# Altium project druino_uno.PrjPcb
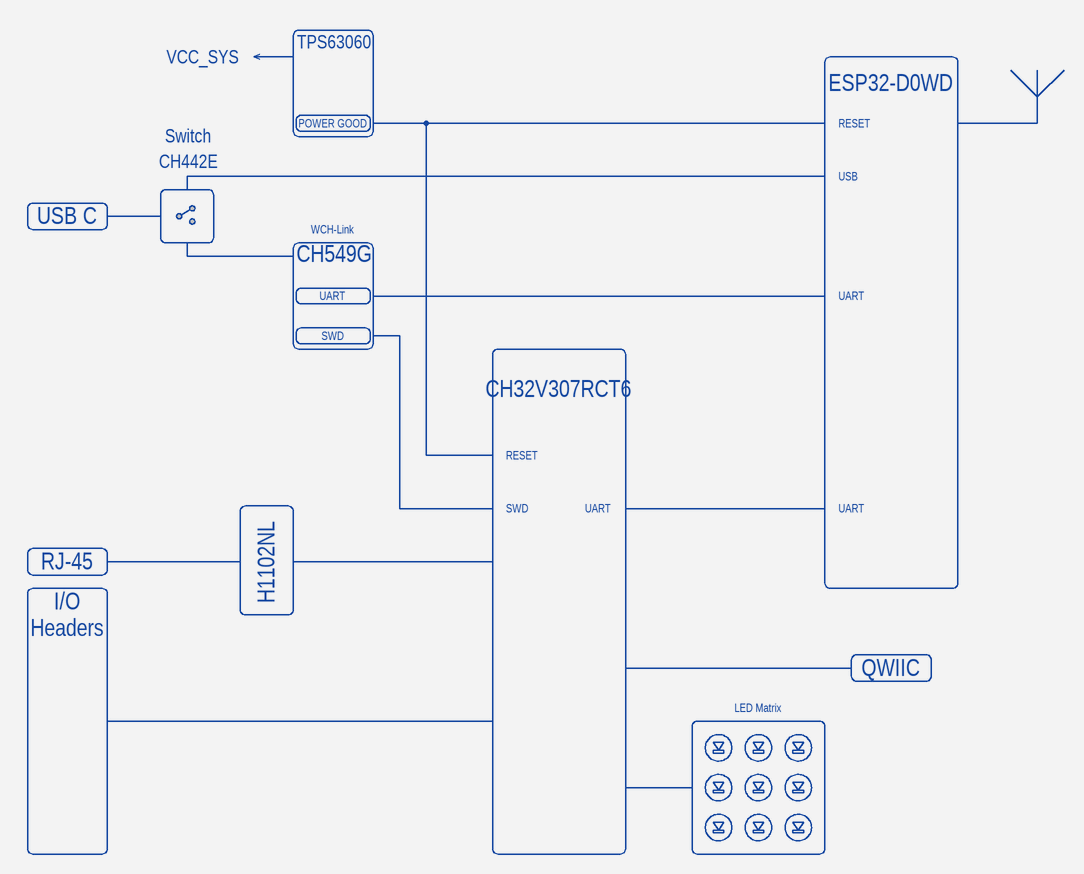
[diagram p0: p1_structure.SchDoc]
6 sheets, 174 parts. Net scope: global (net labels, ports and power ports of the same name join across sheets).
Board file: druino_uno_pcb.PcbDoc
Sheets:
  p1_structure.SchDoc
  p2_power_tree.SchDoc
  p4_esp32.SchDoc
  p5_ethernet.SchDoc
  p6_wch_link.SchDoc
  p8_led_matrix.SchDoc

## Sheet p1_structure.SchDoc
size A4; Organization: ORGANIZATION; Address1: ADDRESS 1; Address2: ADDRESS 2; Address3: ADDRESS 3; Address4: ADDRESS 4; Revision: Rev. A; ENG_APP_DATE: --/--/--; DSN_APP_DATE: --/--/--; CHK_APP_DATE: --/--/--

### Notes on the sheet
- VCC_SYS
- TPS63060
- POWER GOOD
- RESET
- ESP32-D0WD
- Switch
- CH442E
- USB
- USB C
- WCH-Link
- CH549G
- UART
- SWD
- CH32V307RCT6
- RJ-45
- I/O
- H1102NL
- Headers
- QWIIC
- LED Matrix
- A4
- GitHub <https://github.com/kirra-cat/druino-uno>
- view on

## Sheet p2_power_tree.SchDoc
size A4; Organization: ORGANIZATION; Address1: ADDRESS 1; Address2: ADDRESS 2; Address3: ADDRESS 3; Address4: ADDRESS 4; Revision: Rev. A; ENG_APP_DATE: --/--/--; DSN_APP_DATE: --/--/--; CHK_APP_DATE: --/--/--
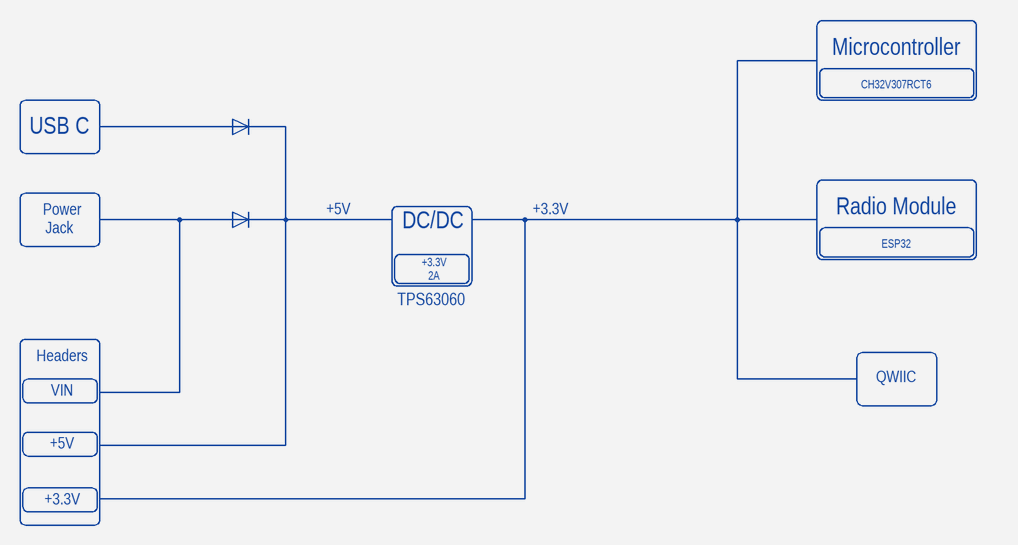
[diagram p1: p2_power_tree.SchDoc]

### Notes on the sheet
- Microcontroller
- USB C
- CH32V307RCT6
- Power
- Radio Module
- Jack
- +5V
- DC/DC
- +3.3V
- 2A
- ESP32
- TPS63060
- Headers
- VIN
- QWIIC
- A4
- GitHub <https://github.com/kirra-cat/druino-uno>
- view on

## Sheet p4_esp32.SchDoc
size A2; Organization: ORGANIZATION; Address1: ADDRESS 1; Address2: ADDRESS 2; Address3: ADDRESS 3; Address4: ADDRESS 4; Revision: Rev. A; ENG_APP_DATE: --/--/--; DSN_APP_DATE: --/--/--; CHK_APP_DATE: --/--/--
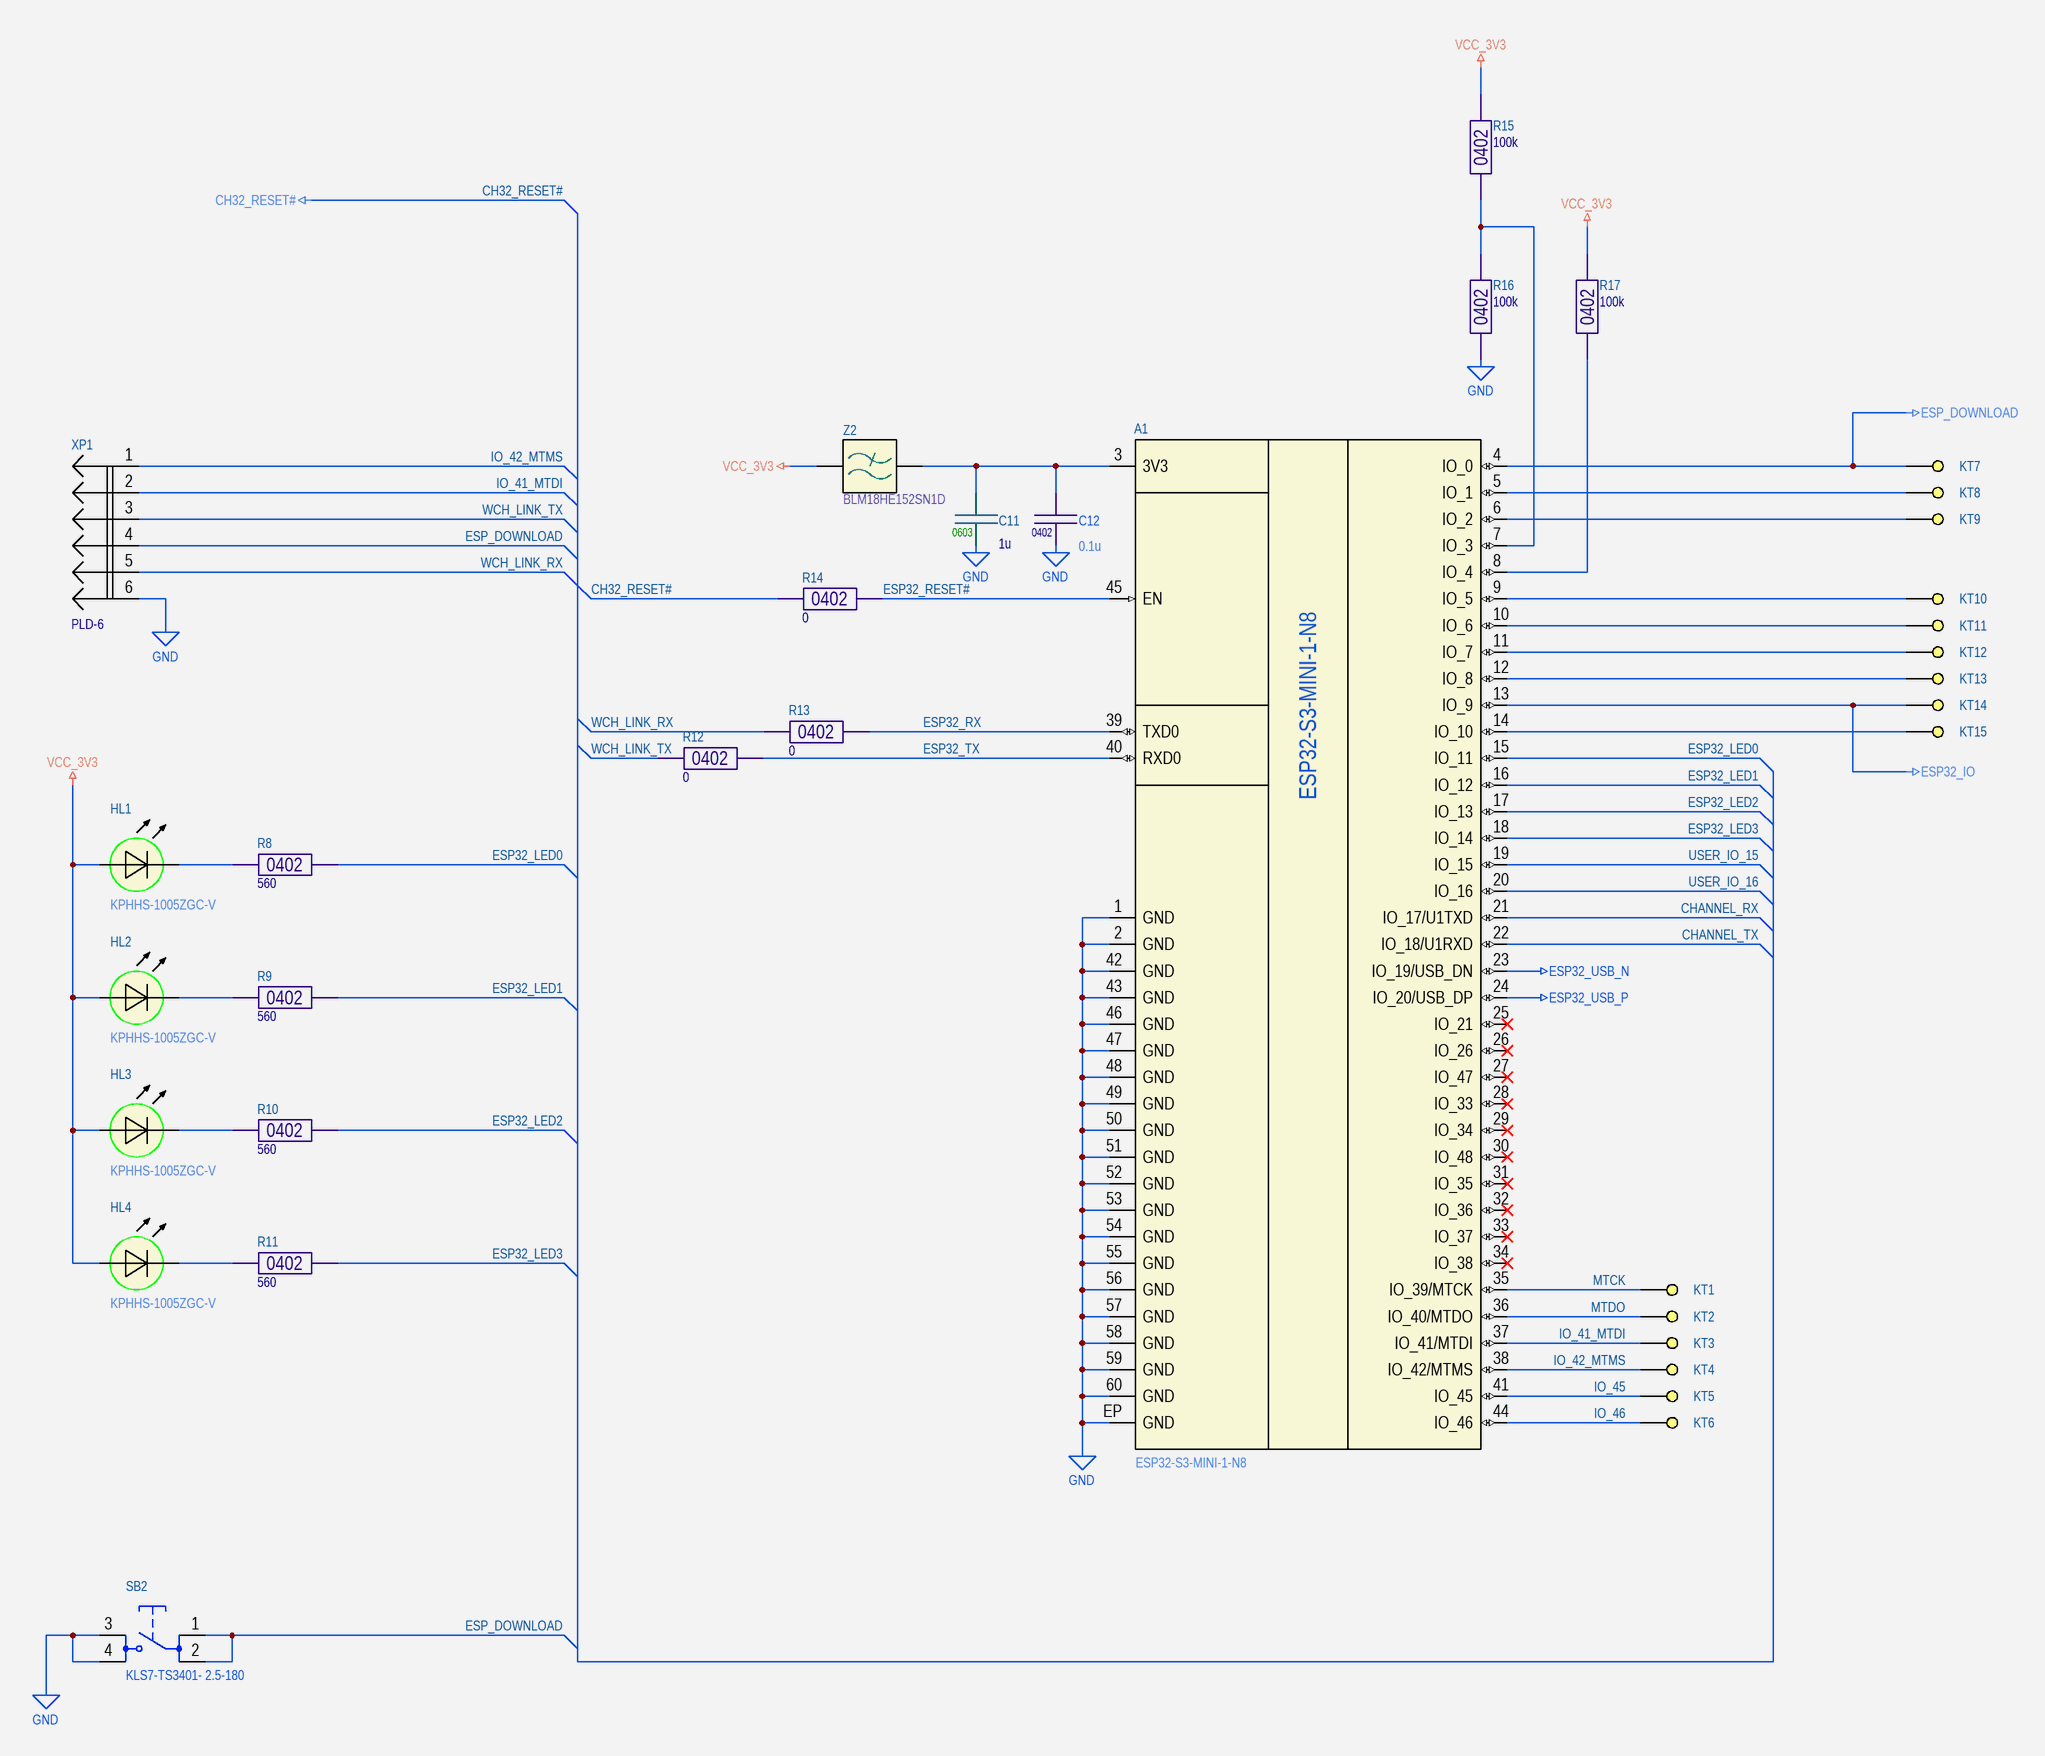
[diagram p2: p4_esp32.SchDoc]

### Parts
A1  ESP32-S3-MINI-1-N8  [ESP32-S3-MINI-1]
C11  1u  Package: 0603  [CAP0603]
C12  0.1u  Package: 0402  [CAP0402]
HL1  KPHHS-1005ZGC-V  [LED0402G525]
HL2  KPHHS-1005ZGC-V  [LED0402G525]
HL3  KPHHS-1005ZGC-V  [LED0402G525]
HL4  KPHHS-1005ZGC-V  [LED0402G525]
KT1  TEST_PAD  [TEST_PAD_R1mm]  (value not drawn)  (net tie, no BOM)
KT2  TEST_PAD  [TEST_PAD_R1mm]  (value not drawn)  (net tie, no BOM)
KT3  TEST_PAD  [TEST_PAD_R1mm]  (value not drawn)  (net tie, no BOM)
KT4  TEST_PAD  [TEST_PAD_R1mm]  (value not drawn)  (net tie, no BOM)
KT5  TEST_PAD  [TEST_PAD_R1mm]  (value not drawn)  (net tie, no BOM)
KT6  TEST_PAD  [TEST_PAD_R1mm]  (value not drawn)  (net tie, no BOM)
KT7  TEST_PAD  [TEST_PAD_R1mm]  (value not drawn)  (net tie, no BOM)
KT8  TEST_PAD  [TEST_PAD_R1mm]  (value not drawn)  (net tie, no BOM)
KT9  TEST_PAD  [TEST_PAD_R1mm]  (value not drawn)  (net tie, no BOM)
KT10  TEST_PAD  [TEST_PAD_R1mm]  (value not drawn)  (net tie, no BOM)
KT11  TEST_PAD  [TEST_PAD_R1mm]  (value not drawn)  (net tie, no BOM)
KT12  TEST_PAD  [TEST_PAD_R1mm]  (value not drawn)  (net tie, no BOM)
KT13  TEST_PAD  [TEST_PAD_R1mm]  (value not drawn)  (net tie, no BOM)
KT14  TEST_PAD  [TEST_PAD_R1mm]  (value not drawn)  (net tie, no BOM)
KT15  TEST_PAD  [TEST_PAD_R1mm]  (value not drawn)  (net tie, no BOM)
R8  560  Package: 0402  [RES0402B]
R9  560  Package: 0402  [RES0402B]
R10  560  Package: 0402  [RES0402B]
R11  560  Package: 0402  [RES0402B]
R12  0  Package: 0402  [RES0402B]
R13  0  Package: 0402  [RES0402B]
R14  0  Package: 0402  [RES0402B]
R15  100k  Package: 0402  [RES0402B]
R16  100k  Package: 0402  [RES0402B]
R17  100k  Package: 0402  [RES0402B]
SB2  KLS7-TS3401- 2.5-180  [TVAF11]
XP1  PLD-6  [PLD-6]
Z2  BLM18HE152SN1D  [BLM0603C]

### Nets
CH32_RESET#: R14.2
ESP32_IO: A1.13(IO_9) KT14.1
ESP32_USB_N: A1.23(IO_19/USB_DN)
ESP32_USB_P: A1.24(IO_20/USB_DP)
ESP_DOWNLOAD: A1.4(IO_0) KT7.1 SB2.1 SB2.2 XP1.4
GND: A1.1(GND) A1.2(GND) A1.42(GND) A1.43(GND) A1.46(GND) A1.47(GND) A1.48(GND) A1.49(GND) A1.50(GND) A1.51(GND) A1.52(GND) A1.53(GND) A1.54(GND) A1.55(GND) A1.56(GND) A1.57(GND) A1.58(GND) A1.59(GND) A1.60(GND) A1.EP(GND) C11.1 C12.2 R16.2 SB2.3 SB2.4 XP1.6
VCC_3V3: HL1.2 HL2.2 HL3.2 HL4.2 R15.1 R17.1 Z2.2
WCH_LINK_RX: R13.1 XP1.5
WCH_LINK_TX: R12.1 XP1.3
CHANNEL_RX: A1.21(IO_17/U1TXD)
CHANNEL_TX: A1.22(IO_18/U1RXD)
ESP32_LED0: A1.15(IO_11) R8.2
ESP32_LED1: A1.16(IO_12) R9.2
ESP32_LED2: A1.17(IO_13) R10.2
ESP32_LED3: A1.18(IO_14) R11.2
ESP32_RESET#: A1.45(EN) R14.1
ESP32_RX: A1.39(TXD0) R13.2
ESP32_TX: A1.40(RXD0) R12.2
IO_41_MTDI: A1.37(IO_41/MTDI) KT3.1 XP1.2
IO_42_MTMS: A1.38(IO_42/MTMS) KT4.1 XP1.1
IO_45: A1.41(IO_45) KT5.1
IO_46: A1.44(IO_46) KT6.1
MTCK: A1.35(IO_39/MTCK) KT1.1
MTDO: A1.36(IO_40/MTDO) KT2.1
USER_IO_15: A1.19(IO_15)
USER_IO_16: A1.20(IO_16)
NetA1_3: A1.3(3V3) C11.2 C12.1 Z2.1
NetA1_5: A1.5(IO_1) KT8.1
NetA1_6: A1.6(IO_2) KT9.1
NetA1_7: A1.7(IO_3) R15.2 R16.1
NetA1_8: A1.8(IO_4) R17.2
NetA1_9: A1.9(IO_5) KT10.1
NetA1_10: A1.10(IO_6) KT11.1
NetA1_11: A1.11(IO_7) KT12.1
NetA1_12: A1.12(IO_8) KT13.1
NetA1_14: A1.14(IO_10) KT15.1
NetHL1_1: HL1.1 R8.1
NetHL2_1: HL2.1 R9.1
NetHL3_1: HL3.1 R10.1
NetHL4_1: HL4.1 R11.1

Not connected (* = marked no-connect by the designer): A1 25(IO_21)* 26(IO_26)* 27(IO_47)* 28(IO_33)* 29(IO_34)* 30(IO_48)* 31(IO_35)* 32(IO_36)* 33(IO_37)* 34(IO_38)*

### Notes on the sheet
- A2
- GitHub <https://github.com/kirra-cat/druino-uno>
- view on

### Library data of the parts
A1 = ESP32-S3-MINI-1-N8: 2.4 GHz WiFi + Bluetooth® + Bluetooth LE module; Manufacturer: Espressif Systems; Part Number: ESP32-S3-MINI-1-N8
C11 = C0603: Capacitors 0603 package case; Part Number: TCC0603X7R106M6R3CT; Manufacturer: CCTC; Tolerance: ± 20 %; Dielectric: X7R; Voltage: 6.3V; Value: 1u; Value on schem: 1u
C12 = C0402: Capacitors 0402 package case; Part Number: TCC0402X7R104J500AT; Manufacturer: CCTC; Tolerance: ± 5 %; Dielectric: X7R; Voltage: 50 V; Value: 0.1u; Value on schem: 0.1u
HL1-HL4 = KPHHS-1005ZGC-V: Green led (package case 0402); Manufacturer: Kingbright Company LLC.; Designator: HL*; Forward Current: 20 mA; Forward Voltage: 3.3V; Wavelength: 515 nm; Package: 0402; Part Number: KPHHS-1005ZGC-V; Color: Green
KT1-KT15 = TEST_PAD: Test pad
R8-R11 = R0402: Resistor 0402 package case; Part Number: RC0402FR-07560RL; Manufacturer: Yageo; Tolerance: ± 1 %; Temperature Coefficient: ±100 ppm/K; Value: 560; Value on schem: 560
R12-R14 = R0402: Resistor 0402 package case; Part Number: RC0402FR-070RL; Manufacturer: Yageo; Tolerance: ± 1 %; Temperature Coefficient: ±100 ppm/K; Value: 0; Value on schem: 0
R15-R17 = R0402: Resistor 0402 package case; Part Number: RC0402FR-07100KL; Manufacturer: Yageo; Tolerance: ± 1 %; Temperature Coefficient: ±100 ppm/K; Value: 100k; Value on schem: 100k
SB2 = TVAF11: Tact Button SMD 4х3х2.5mm; Manufacturer: KLS; Package: 3x4mm; Part Number: KLS7-TS3401- 2.5-180
Z2 = BLM18HE152SN1D: Power line filter, imperdance 1500 Ohm @100MHz (current 0.5A); Manufacturer: Murata; Part Number: BLM18HE152SN1D; Package: 0603
XP1 = PLD-6: Value: PLD-6

## Sheet p5_ethernet.SchDoc
size A3; Organization: ORGANIZATION; Address1: ADDRESS 1; Address2: ADDRESS 2; Address3: ADDRESS 3; Address4: ADDRESS 4; Revision: Rev. A; ENG_APP_DATE: --/--/--; DSN_APP_DATE: --/--/--; CHK_APP_DATE: --/--/--
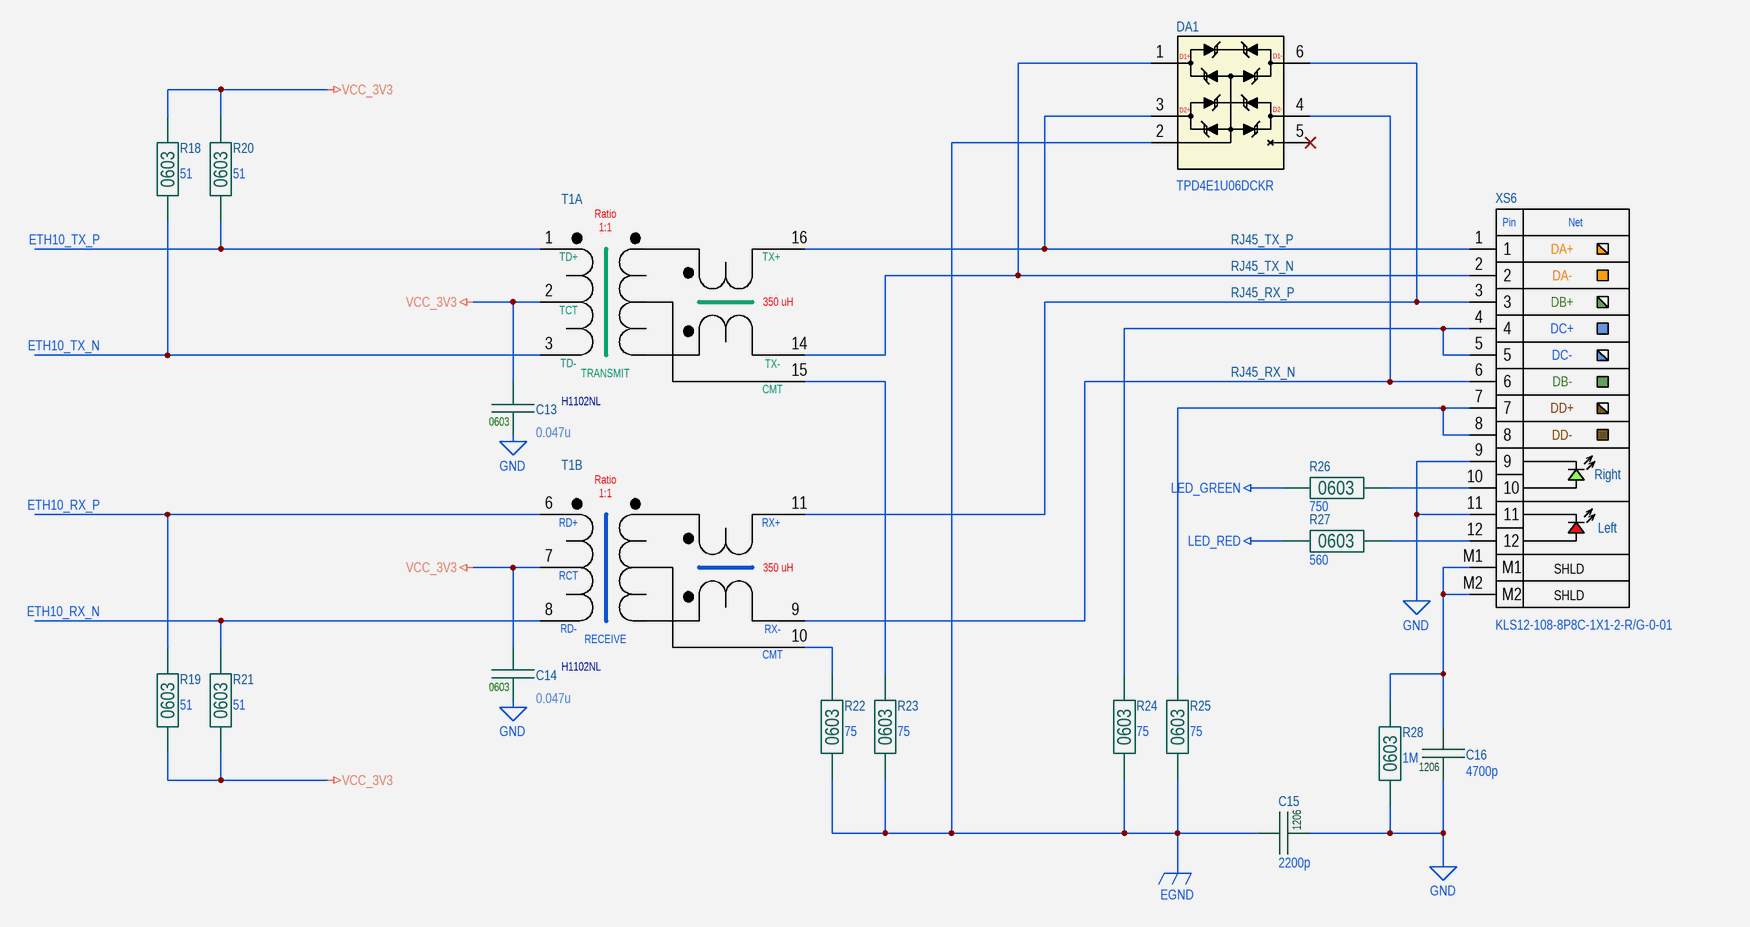
[diagram p3: p5_ethernet.SchDoc]

### Parts
C13  0.047u  Package: 0603  [CAP0603]
C14  0.047u  Package: 0603  [CAP0603]
C15  2200p  Package: 1206  [CAP1206-1.0]
C16  4700p  Package: 1206  [CAP1206-1.4]
DA1  TPD4E1U06DCKR  [SC70-6]
R18  51  Package: 0603  [RES0603B]
R19  51  Package: 0603  [RES0603B]
R20  51  Package: 0603  [RES0603B]
R21  51  Package: 0603  [RES0603B]
R22  75  Package: 0603  [RES0603B]
R23  75  Package: 0603  [RES0603B]
R24  75  Package: 0603  [RES0603B]
R25  75  Package: 0603  [RES0603B]
R26  750  Package: 0603  [RES0603B]
R27  560  Package: 0603  [RES0603B]
R28  1M  Package: 0603  [RES0603B]
T1  H1102NL  [H1102NL]  (parts A,B of 2)
XS6  KLS12-108-8P8C-1X1-2-R/G-0-01  [L-KLS12-108-8P8C_SLOTS]

### Nets
EGND: C15.1 DA1.2(GND) R22.1 R23.1 R24.1 R25.1
GND: C13.1 C14.1 C15.2 C16.1 R28.1 XS6.9 XS6.11
LED_GREEN: R26.2
LED_RED: R27.2
VCC_3V3: C13.2 C14.2 R18.2 R19.1 R20.2 R21.1 T1.2(TCT) T1.7(RCT)
ETH10_RX_N: R21.2 T1.8(RD-)
ETH10_RX_P: R19.2 T1.6(RD+)
ETH10_TX_N: R18.1 T1.3(TD-)
ETH10_TX_P: R20.1 T1.1(TD+)
RJ45_RX_N: DA1.4(D2-) T1.9(RX-) XS6.6
RJ45_RX_P: DA1.6(D1-) T1.11(RX+) XS6.3
RJ45_TX_N: DA1.1(D1+) T1.14(TX-) XS6.2
RJ45_TX_P: DA1.3(D2+) T1.16(TX+) XS6.1
NetC16_2: C16.2 R28.2 XS6.M1 XS6.M2
NetR22_2: R22.2 T1.10(CMTR)
NetR23_2: R23.2 T1.15(CMTT)
NetR24_2: R24.2 XS6.4 XS6.5
NetR25_2: R25.2 XS6.7 XS6.8
NetR26_1: R26.1 XS6.10
NetR27_1: R27.1 XS6.12

Not connected (* = marked no-connect by the designer): DA1 5(NC)*

### Notes on the sheet
- A3
- GitHub <https://github.com/kirra-cat/druino-uno>
- view on
- (in symbol H1102NL, part A) Ratio; 1:1; 350 uH; TRANSMIT; CMT
- (in symbol H1102NL, part B) Ratio; 1:1; 350 uH; RECEIVE; CMT
- (in symbol KLS12-108-8P8C-1X1-2-R/G-0-01) Pin; Net; DA+; DA-; DB+; DC+; DC-; DB-; DD+; DD-; Right; Left; SHLD

### Library data of the parts
C13 C14 = C0603: Capacitors 0603 package case; Part Number: TCC0603X7R473K500CT; Manufacturer: CCTC; Tolerance: ± 10 %; Dielectric: X7R; Voltage: 50V; Value: 0.047u; Value on schem: 0.047u
C15 = C1206: Capacitors 1206 package case; Part Number: TCC1206X7R222K102FT; Manufacturer: CCTC; Tolerance: ± 10 %; Dielectric: X7R; Voltage: 1000V; Value: 2200p; Value on schem: 2200p
C16 = C1206: Capacitors 1206 package case; Part Number: TCC1206X7R472K102FT; Manufacturer: CCTC; Tolerance: ± 10 %; Dielectric: X7R; Voltage: 1000V; Value: 4700p; Value on schem: 4700p
DA1 = TPD4E1U06DCKR: 6 Quad-Channel, High-Speed ESD Protection Device; Manufacturer: Texas Instruments; Part Number: TPD4E1U06DCKR; Package: SC70-6
R18-R21 = R0603: Resistor 0603 package case; Part Number: RC0603FR-0751RL; Manufacturer: Yageo; Tolerance: ± 1 %; Voltage: 100V; Temperature Coefficient: ±100/K; Value: 51; Value on schem: 51
R22-R25 = R0603: Resistor 0603 package case; Part Number: RC0603FR-0775RL; Manufacturer: Yageo; Tolerance: ± 1 %; Voltage: 100V; Temperature Coefficient: ±100/K; Value: 75; Value on schem: 75
R26 = R0603: Resistor 0603 package case; Part Number: RC0603FR-07750RL; Manufacturer: Yageo; Tolerance: ± 1 %; Voltage: 100V; Temperature Coefficient: ±100/K; Value: 750; Value on schem: 750
R27 = R0603: Resistor 0603 package case; Part Number: RC0603FR-07560RL; Manufacturer: Yageo; Tolerance: ± 1 %; Voltage: 100V; Temperature Coefficient: ±100/K; Value: 560; Value on schem: 560
R28 = R0603: Resistor 0603 package case; Part Number: RC0603FR-071ML; Manufacturer: Yageo; Tolerance: ± 1 %; Voltage: 100V; Temperature Coefficient: ±100/K; Value: 1M; Value on schem: 1M
T1 = H1102NL: 10/100BASE-T Ethernet transformer Ratio 1:1 350 uH; Manufacturer: Pulse Electronics; Part Number: H1102NL
XS6 = KLS12-108-8P8C-1X1-2-R/G-0-01: RJ-45; Manufacturer: KLS; Part Number: KLS12-108-8P8C-1X1-2-R/G-0-01; Author: Sklyarov

## Sheet p6_wch_link.SchDoc
size A3; Organization: ORGANIZATION; Address1: ADDRESS 1; Address2: ADDRESS 2; Address3: ADDRESS 3; Address4: ADDRESS 4; Revision: Rev. A; ENG_APP_DATE: --/--/--; DSN_APP_DATE: --/--/--; CHK_APP_DATE: --/--/--
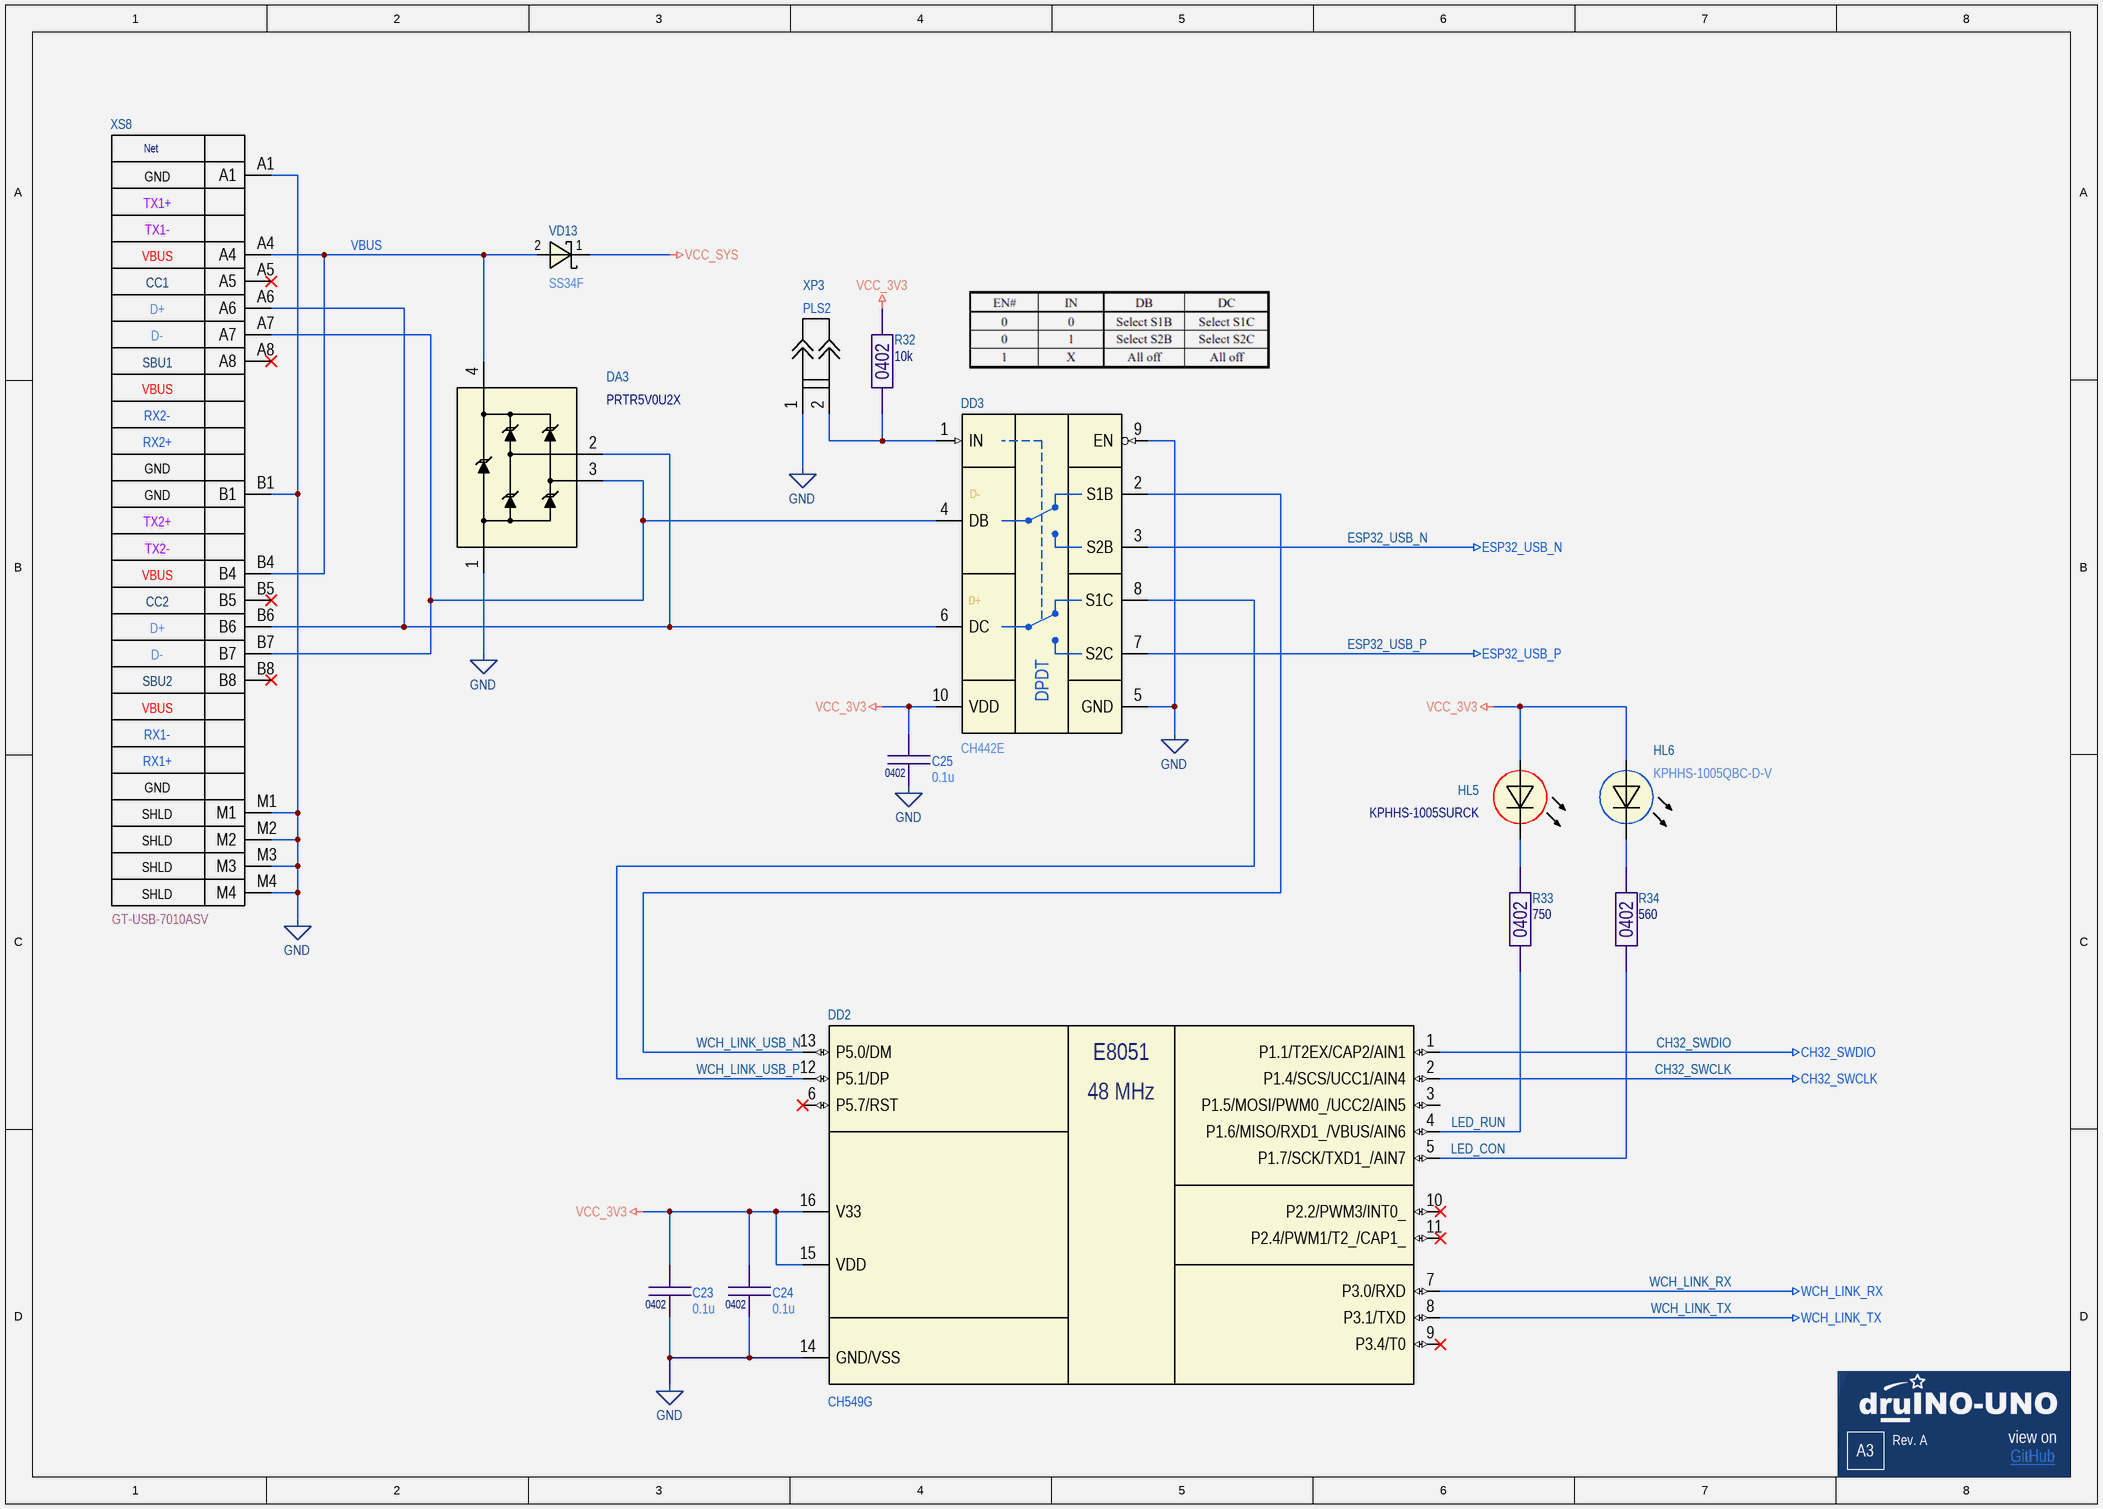
[diagram p4: p6_wch_link.SchDoc]

### Parts
C23  0.1u  Package: 0402  [CAP0402]
C24  0.1u  Package: 0402  [CAP0402]
C25  0.1u  Package: 0402  [CAP0402]
DA3  PRTR5V0U2X  [SOT143]
DD2  CH549G  [SOIC-16]
DD3  CH442E  [MSOP-10]
HL5  KPHHS-1005SURCK  [LED0402R]
HL6  KPHHS-1005QBC-D-V  [LED0402B]
R32  10k  Package: 0402  [RES0402B]
R33  750  Package: 0402  [RES0402B]
R34  560  Package: 0402  [RES0402B]
VD13  SS34F  [SMA-FL]
XP3  PLS2  [PLS-2]
XS8  GT-USB-7010ASV  [GT-USB-7010ASV]

### Nets
CH32_SWCLK: DD2.2(P1.4/SCS/UCC1/AIN4)
CH32_SWDIO: DD2.1(P1.1/T2EX/CAP2/AIN1)
ESP32_USB_N: DD3.3(S2B)
ESP32_USB_P: DD3.7(S2C)
GND: C23.2 C24.2 C25.2 DA3.1(GND) DD2.14(GND/VSS) DD3.5(GND) DD3.9(EN) XP3.1 XS8.A1 XS8.B1 XS8.M1 XS8.M2 XS8.M3 XS8.M4
VCC_3V3: C23.1 C24.1 C25.1 DD2.15(VDD) DD2.16(V33) DD3.10(VDD) HL5.2 HL6.2 R32.1
VCC_SYS: VD13.1
WCH_LINK_RX: DD2.7(P3.0/RXD)
WCH_LINK_TX: DD2.8(P3.1/TXD)
LED_CON: DD2.5(P1.7/SCK/TXD1_/AIN7) R34.2
LED_RUN: DD2.4(P1.6/MISO/RXD1_/VBUS/AIN6) R33.2
VBUS: DA3.4(VCC) VD13.2 XS8.A4 XS8.B4
WCH_LINK_USB_N: DD2.13(P5.0/DM) DD3.2(S1B)
WCH_LINK_USB_P: DD2.12(P5.1/DP) DD3.8(S1C)
NetDA3_2: DA3.2(IO1) DD3.6(DC) XS8.A6 XS8.B6
NetDA3_3: DA3.3(IO2) DD3.4(DB) XS8.A7 XS8.B7
NetDD3_1: DD3.1(IN) R32.2 XP3.2
NetHL5_1: HL5.1 R33.1
NetHL6_1: HL6.1 R34.1

Not connected (* = marked no-connect by the designer): DD2 3(P1.5/MOSI/PWM0_/UCC2/AIN5) 6(P5.7/RST)* 9(P3.4/T0)* 10(P2.2/PWM3/INT0_)* 11(P2.4/PWM1/T2_/CAP1_)*; XS8 A5* A8* B5* B8*

### Notes on the sheet
- (near DD3) D-
- (near DD3) D+
- A3
- GitHub <https://github.com/kirra-cat/druino-uno>
- view on
- (in symbol CH442E) DPDT
- (in symbol CH549G) E8051; 48 MHz
- (in symbol GT-USB-7010ASV) Net; GND; TX1+; TX1-; VBUS; CC1; D+; D-; SBU1; RX2-; RX2+; TX2+; TX2-; CC2; SBU2; RX1-; RX1+; SHLD

### Library data of the parts
C23-C25 = C0402: as C12 on sheet p4_esp32; Value: 0.1u; Value on schem: 0.1u
DA3 = PRTR5V0U2X: Ultra low capacitance double rail-to-rail ESD protection diode; Manufacturer: NXP USA Inc.; Part Number: PRTR5V0U2X; Package: SOT-143
DD2 = CH549G: 8-bit Enhanced USB MCU; Manufacturer: WinChipHead; Package: SOP16; Part Number: CH549G
DD3 = CH442E: Double-pole Double-throw Low-Resistance Analog Switch IC; Manufacturer: WinChipHead; Package: MSOP-10; Part Number: CH442E
HL5 = KPHHS-1005SURCK: Red led (package case 0402); Manufacturer: Kingbright Company LLC.; Designator: HL*; Forward Current: 20 mA; Forward Voltage: 1.95V; Wavelength: 630 nm; Package: 0402; Part Number: KPHHS-1005SURCK; Color: Red
HL6 = KPHHS-1005QBC-D-V: Blue led (package case 0402); Manufacturer: Kingbright Company LLC.; Designator: HL*; Forward Current: 20 mA; Forward Voltage: 3.3V; Wavelength: 465 nm; Package: 0402; Part Number: KPHHS-1005QBC-D-V; Color: Blue
R32 = R0402: Resistor 0402 package case; Part Number: RC0402FR-0710KL; Manufacturer: Yageo; Tolerance: ± 1 %; Temperature Coefficient: ±100 ppm/K; Value: 10k; Value on schem: 10k
R33 = R0402: Resistor 0402 package case; Part Number: RC0402FR-07750RL; Manufacturer: Yageo; Tolerance: ± 1 %; Temperature Coefficient: ±100 ppm/K; Value: 750; Value on schem: 750
R34 = R0402: as R8 on sheet p4_esp32; Value: 560; Value on schem: 560
VD13 = SS34F: 3A Schottky barrier rectifier; Manufacturer: UMW; Package: SMAF; Part Number: SS34F
XS8 = GT-USB-7010ASV: USB 2.0 Female 3A Surface 16P; Manufacturer: G-Switch; Part Number: GT-USB-7010ASV
XP3 = PLS2: Value: PLS2

## Sheet p8_led_matrix.SchDoc
size A1; Organization: ORGANIZATION; Address1: ADDRESS 1; Address2: ADDRESS 2; Address3: ADDRESS 3; Address4: ADDRESS 4; Revision: Rev. A; ENG_APP_DATE: --/--/--; DSN_APP_DATE: --/--/--; CHK_APP_DATE: --/--/--
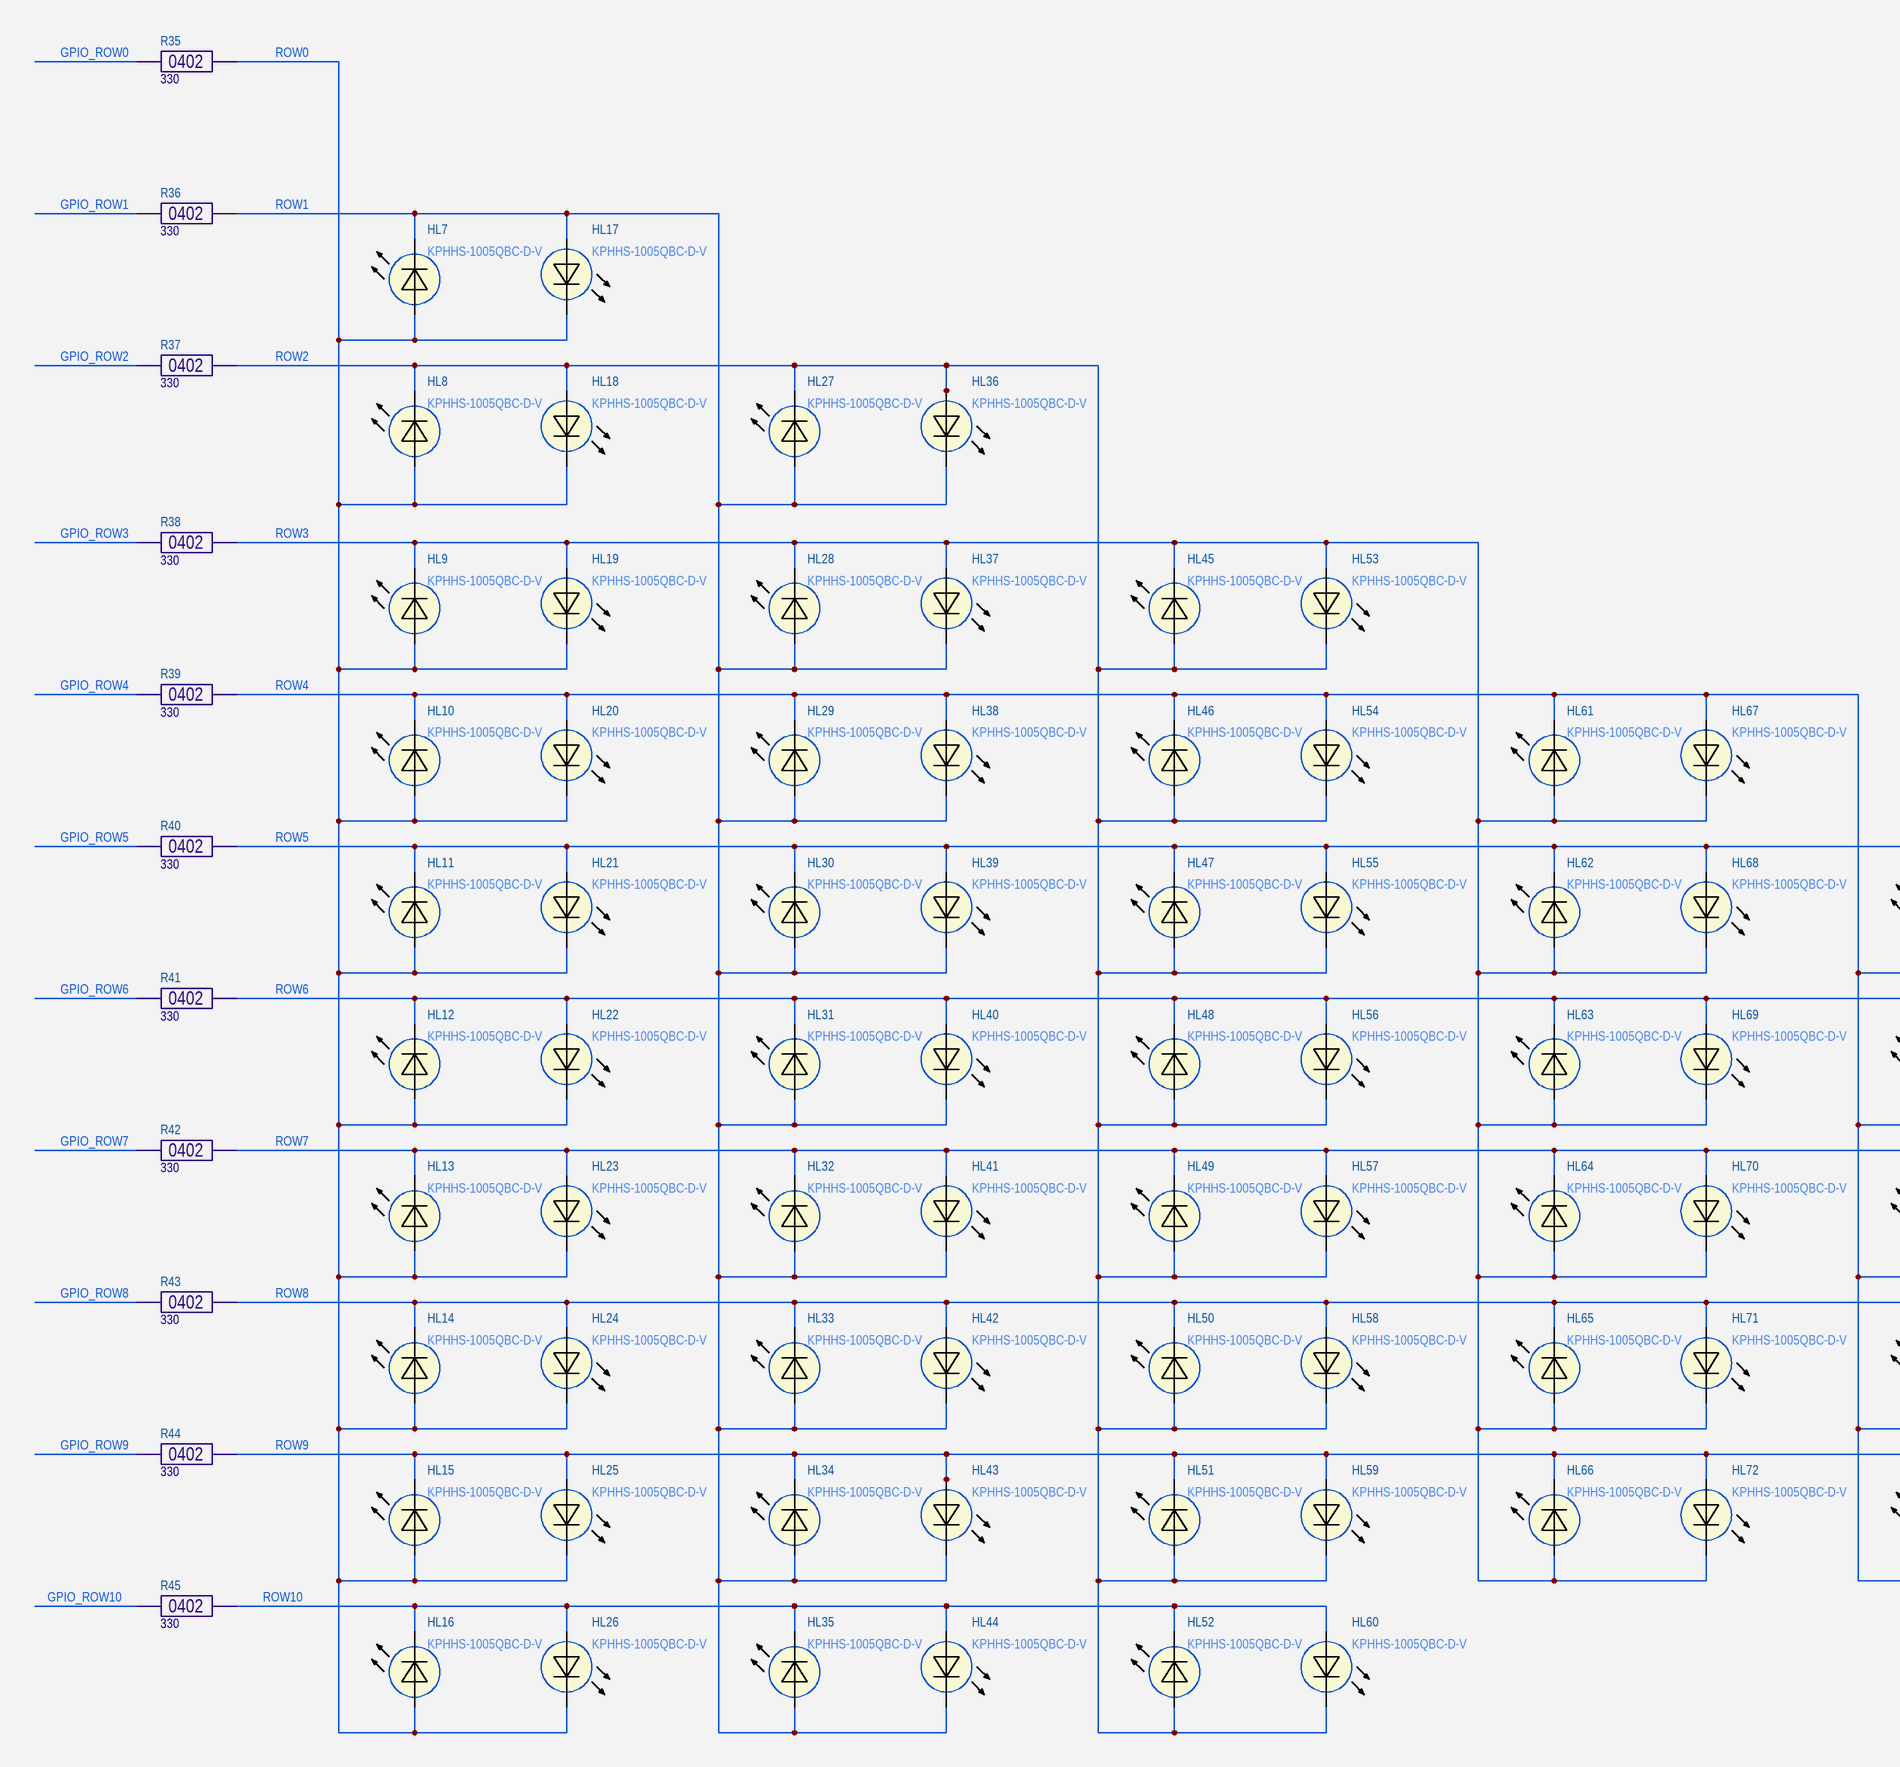
[diagram p5: p8_led_matrix.SchDoc, left]
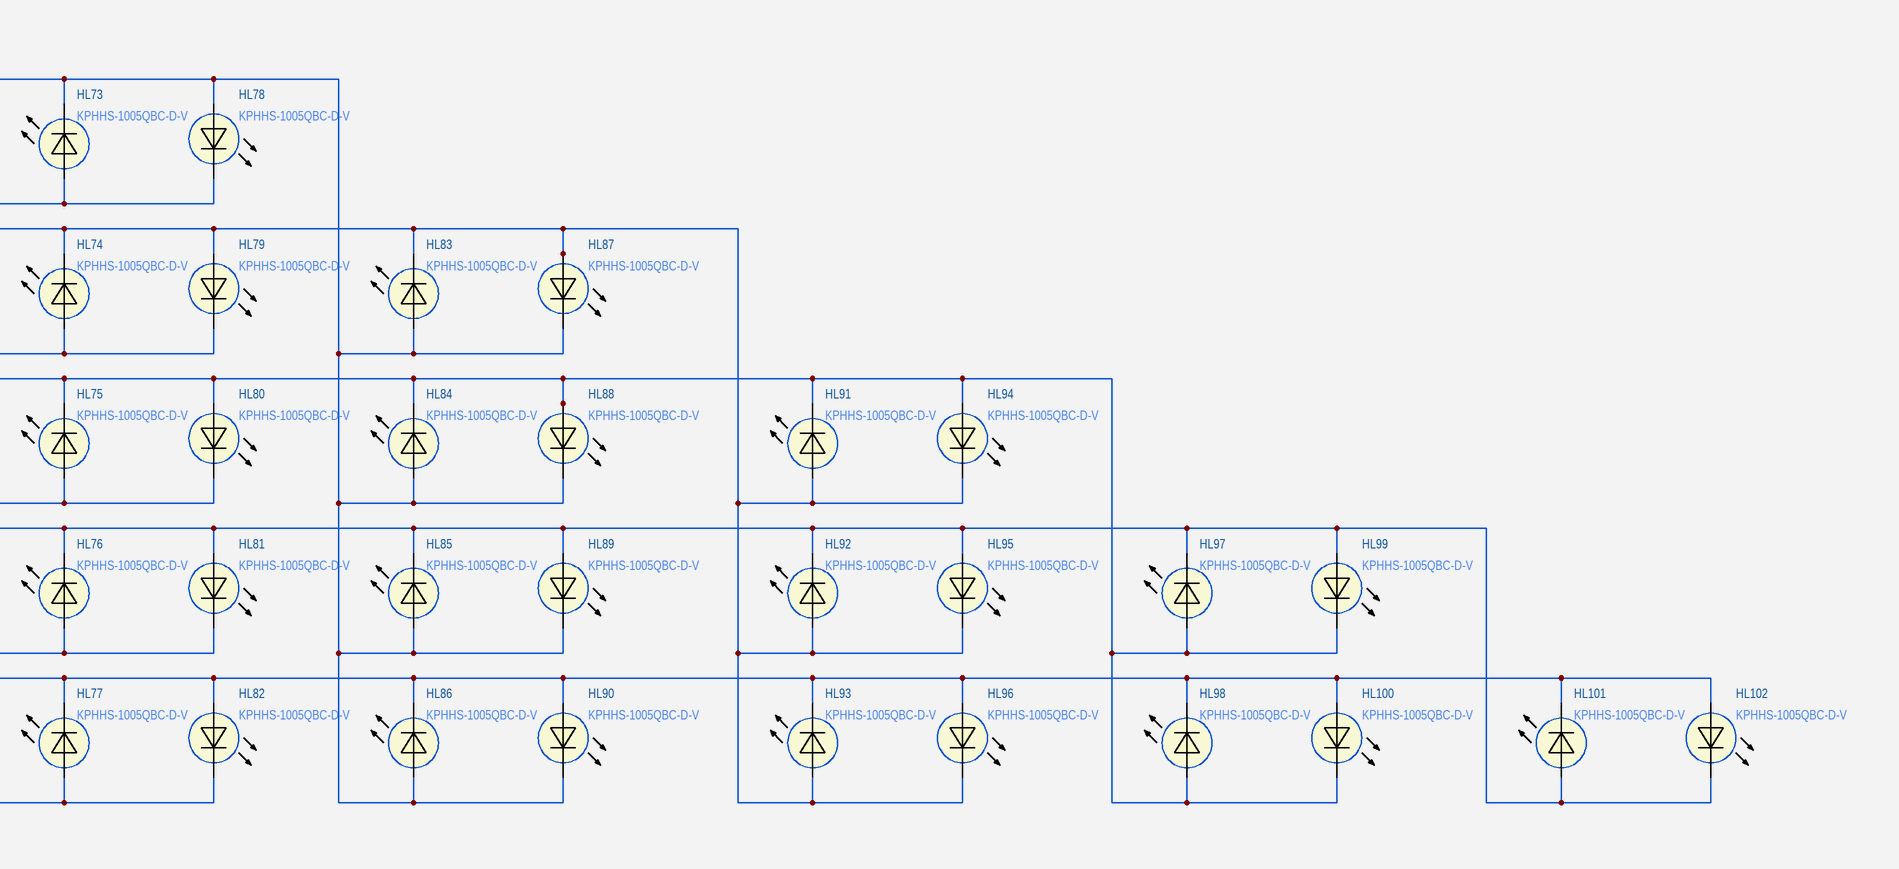
[diagram p6: p8_led_matrix.SchDoc, right]

### Parts
HL7  KPHHS-1005QBC-D-V  [LED0402B]
HL8  KPHHS-1005QBC-D-V  [LED0402B]
HL9  KPHHS-1005QBC-D-V  [LED0402B]
HL10  KPHHS-1005QBC-D-V  [LED0402B]
HL11  KPHHS-1005QBC-D-V  [LED0402B]
HL12  KPHHS-1005QBC-D-V  [LED0402B]
HL13  KPHHS-1005QBC-D-V  [LED0402B]
HL14  KPHHS-1005QBC-D-V  [LED0402B]
HL15  KPHHS-1005QBC-D-V  [LED0402B]
HL16  KPHHS-1005QBC-D-V  [LED0402B]
HL17  KPHHS-1005QBC-D-V  [LED0402B]
HL18  KPHHS-1005QBC-D-V  [LED0402B]
HL19  KPHHS-1005QBC-D-V  [LED0402B]
HL20  KPHHS-1005QBC-D-V  [LED0402B]
HL21  KPHHS-1005QBC-D-V  [LED0402B]
HL22  KPHHS-1005QBC-D-V  [LED0402B]
HL23  KPHHS-1005QBC-D-V  [LED0402B]
HL24  KPHHS-1005QBC-D-V  [LED0402B]
HL25  KPHHS-1005QBC-D-V  [LED0402B]
HL26  KPHHS-1005QBC-D-V  [LED0402B]
HL27  KPHHS-1005QBC-D-V  [LED0402B]
HL28  KPHHS-1005QBC-D-V  [LED0402B]
HL29  KPHHS-1005QBC-D-V  [LED0402B]
HL30  KPHHS-1005QBC-D-V  [LED0402B]
HL31  KPHHS-1005QBC-D-V  [LED0402B]
HL32  KPHHS-1005QBC-D-V  [LED0402B]
HL33  KPHHS-1005QBC-D-V  [LED0402B]
HL34  KPHHS-1005QBC-D-V  [LED0402B]
HL35  KPHHS-1005QBC-D-V  [LED0402B]
HL36  KPHHS-1005QBC-D-V  [LED0402B]
HL37  KPHHS-1005QBC-D-V  [LED0402B]
HL38  KPHHS-1005QBC-D-V  [LED0402B]
HL39  KPHHS-1005QBC-D-V  [LED0402B]
HL40  KPHHS-1005QBC-D-V  [LED0402B]
HL41  KPHHS-1005QBC-D-V  [LED0402B]
HL42  KPHHS-1005QBC-D-V  [LED0402B]
HL43  KPHHS-1005QBC-D-V  [LED0402B]
HL44  KPHHS-1005QBC-D-V  [LED0402B]
HL45  KPHHS-1005QBC-D-V  [LED0402B]
HL46  KPHHS-1005QBC-D-V  [LED0402B]
HL47  KPHHS-1005QBC-D-V  [LED0402B]
HL48  KPHHS-1005QBC-D-V  [LED0402B]
HL49  KPHHS-1005QBC-D-V  [LED0402B]
HL50  KPHHS-1005QBC-D-V  [LED0402B]
HL51  KPHHS-1005QBC-D-V  [LED0402B]
HL52  KPHHS-1005QBC-D-V  [LED0402B]
HL53  KPHHS-1005QBC-D-V  [LED0402B]
HL54  KPHHS-1005QBC-D-V  [LED0402B]
HL55  KPHHS-1005QBC-D-V  [LED0402B]
HL56  KPHHS-1005QBC-D-V  [LED0402B]
HL57  KPHHS-1005QBC-D-V  [LED0402B]
HL58  KPHHS-1005QBC-D-V  [LED0402B]
HL59  KPHHS-1005QBC-D-V  [LED0402B]
HL60  KPHHS-1005QBC-D-V  [LED0402B]
HL61  KPHHS-1005QBC-D-V  [LED0402B]
HL62  KPHHS-1005QBC-D-V  [LED0402B]
HL63  KPHHS-1005QBC-D-V  [LED0402B]
HL64  KPHHS-1005QBC-D-V  [LED0402B]
HL65  KPHHS-1005QBC-D-V  [LED0402B]
HL66  KPHHS-1005QBC-D-V  [LED0402B]
HL67  KPHHS-1005QBC-D-V  [LED0402B]
HL68  KPHHS-1005QBC-D-V  [LED0402B]
HL69  KPHHS-1005QBC-D-V  [LED0402B]
HL70  KPHHS-1005QBC-D-V  [LED0402B]
HL71  KPHHS-1005QBC-D-V  [LED0402B]
HL72  KPHHS-1005QBC-D-V  [LED0402B]
HL73  KPHHS-1005QBC-D-V  [LED0402B]
HL74  KPHHS-1005QBC-D-V  [LED0402B]
HL75  KPHHS-1005QBC-D-V  [LED0402B]
HL76  KPHHS-1005QBC-D-V  [LED0402B]
HL77  KPHHS-1005QBC-D-V  [LED0402B]
HL78  KPHHS-1005QBC-D-V  [LED0402B]
HL79  KPHHS-1005QBC-D-V  [LED0402B]
HL80  KPHHS-1005QBC-D-V  [LED0402B]
HL81  KPHHS-1005QBC-D-V  [LED0402B]
HL82  KPHHS-1005QBC-D-V  [LED0402B]
HL83  KPHHS-1005QBC-D-V  [LED0402B]
HL84  KPHHS-1005QBC-D-V  [LED0402B]
HL85  KPHHS-1005QBC-D-V  [LED0402B]
HL86  KPHHS-1005QBC-D-V  [LED0402B]
HL87  KPHHS-1005QBC-D-V  [LED0402B]
HL88  KPHHS-1005QBC-D-V  [LED0402B]
HL89  KPHHS-1005QBC-D-V  [LED0402B]
HL90  KPHHS-1005QBC-D-V  [LED0402B]
HL91  KPHHS-1005QBC-D-V  [LED0402B]
HL92  KPHHS-1005QBC-D-V  [LED0402B]
HL93  KPHHS-1005QBC-D-V  [LED0402B]
HL94  KPHHS-1005QBC-D-V  [LED0402B]
HL95  KPHHS-1005QBC-D-V  [LED0402B]
HL96  KPHHS-1005QBC-D-V  [LED0402B]
HL97  KPHHS-1005QBC-D-V  [LED0402B]
HL98  KPHHS-1005QBC-D-V  [LED0402B]
HL99  KPHHS-1005QBC-D-V  [LED0402B]
HL100  KPHHS-1005QBC-D-V  [LED0402B]
HL101  KPHHS-1005QBC-D-V  [LED0402B]
HL102  KPHHS-1005QBC-D-V  [LED0402B]
R35  330  Package: 0402  [RES0402B]
R36  330  Package: 0402  [RES0402B]
R37  330  Package: 0402  [RES0402B]
R38  330  Package: 0402  [RES0402B]
R39  330  Package: 0402  [RES0402B]
R40  330  Package: 0402  [RES0402B]
R41  330  Package: 0402  [RES0402B]
R42  330  Package: 0402  [RES0402B]
R43  330  Package: 0402  [RES0402B]
R44  330  Package: 0402  [RES0402B]
R45  330  Package: 0402  [RES0402B]

### Nets
GPIO_ROW0: R35.2
GPIO_ROW1: R36.2
GPIO_ROW2: R37.2
GPIO_ROW3: R38.2
GPIO_ROW4: R39.2
GPIO_ROW5: R40.2
GPIO_ROW6: R41.2
GPIO_ROW7: R42.2
GPIO_ROW8: R43.2
GPIO_ROW9: R44.2
GPIO_ROW10: R45.2
ROW0: HL7.2 HL8.2 HL9.2 HL10.2 HL11.2 HL12.2 HL13.2 HL14.2 HL15.2 HL16.2 HL17.1 HL18.1 HL19.1 HL20.1 HL21.1 HL22.1 HL23.1 HL24.1 HL25.1 HL26.1 R35.1
ROW1: HL7.1 HL17.2 HL27.2 HL28.2 HL29.2 HL30.2 HL31.2 HL32.2 HL33.2 HL34.2 HL35.2 HL36.1 HL37.1 HL38.1 HL39.1 HL40.1 HL41.1 HL42.1 HL43.1 HL44.1 R36.1
ROW2: HL8.1 HL18.2 HL27.1 HL36.2 HL45.2 HL46.2 HL47.2 HL48.2 HL49.2 HL50.2 HL51.2 HL52.2 HL53.1 HL54.1 HL55.1 HL56.1 HL57.1 HL58.1 HL59.1 HL60.1 R37.1
ROW3: HL9.1 HL19.2 HL28.1 HL37.2 HL45.1 HL53.2 HL61.2 HL62.2 HL63.2 HL64.2 HL65.2 HL66.2 HL67.1 HL68.1 HL69.1 HL70.1 HL71.1 HL72.1 R38.1
ROW4: HL10.1 HL20.2 HL29.1 HL38.2 HL46.1 HL54.2 HL61.1 HL67.2 HL73.2 HL74.2 HL75.2 HL76.2 HL77.2 HL78.1 HL79.1 HL80.1 HL81.1 HL82.1 R39.1
ROW5: HL11.1 HL21.2 HL30.1 HL39.2 HL47.1 HL55.2 HL62.1 HL68.2 HL73.1 HL78.2 HL83.2 HL84.2 HL85.2 HL86.2 HL87.1 HL88.1 HL89.1 HL90.1 R40.1
ROW6: HL12.1 HL22.2 HL31.1 HL40.2 HL48.1 HL56.2 HL63.1 HL69.2 HL74.1 HL79.2 HL83.1 HL87.2 HL91.2 HL92.2 HL93.2 HL94.1 HL95.1 HL96.1 R41.1
ROW7: HL13.1 HL23.2 HL32.1 HL41.2 HL49.1 HL57.2 HL64.1 HL70.2 HL75.1 HL80.2 HL84.1 HL88.2 HL91.1 HL94.2 HL97.2 HL98.2 HL99.1 HL100.1 R42.1
ROW8: HL14.1 HL24.2 HL33.1 HL42.2 HL50.1 HL58.2 HL65.1 HL71.2 HL76.1 HL81.2 HL85.1 HL89.2 HL92.1 HL95.2 HL97.1 HL99.2 HL101.2 HL102.1 R43.1
ROW9: HL15.1 HL25.2 HL34.1 HL43.2 HL51.1 HL59.2 HL66.1 HL72.2 HL77.1 HL82.2 HL86.1 HL90.2 HL93.1 HL96.2 HL98.1 HL100.2 HL101.1 HL102.2 R44.1
ROW10: HL16.1 HL26.2 HL35.1 HL44.2 HL52.1 HL60.2 R45.1

### Notes on the sheet
- A1
- GitHub <https://github.com/kirra-cat/druino-uno>
- view on

### Library data of the parts
HL7-HL102 = KPHHS-1005QBC-D-V: as HL6 on sheet p6_wch_link; Package: 0402; Part Number: KPHHS-1005QBC-D-V; Color: Blue
R35-R45 = R0402: Resistor 0402 package case; Part Number: RC0402FR-07330RL; Manufacturer: Yageo; Tolerance: ± 1 %; Temperature Coefficient: ±100 ppm/K; Value: 330; Value on schem: 330

## Nets that join several sheets
ESP32_USB_N: p4_esp32 (A1.23), p6_wch_link (DD3.3)
ESP32_USB_P: p4_esp32 (A1.24), p6_wch_link (DD3.7)
GND: p4_esp32 (26 pins), p5_ethernet (7 pins), p6_wch_link (14 pins)
VCC_3V3: p4_esp32 (7 pins), p5_ethernet (8 pins), p6_wch_link (9 pins)
WCH_LINK_RX: p4_esp32 (R13.1 XP1.5), p6_wch_link (DD2.7)
WCH_LINK_TX: p4_esp32 (R12.1 XP1.3), p6_wch_link (DD2.8)